# EAGLE design lcd_duffle_pth_mk_7 (EAGLE 6.5.0)
LCD Dufflebag Ride-along I2C interface for a standard LCD screen, including RGB support. Uses an ATTiny84 plus WS2811 (for backlight control). This is the PTH version
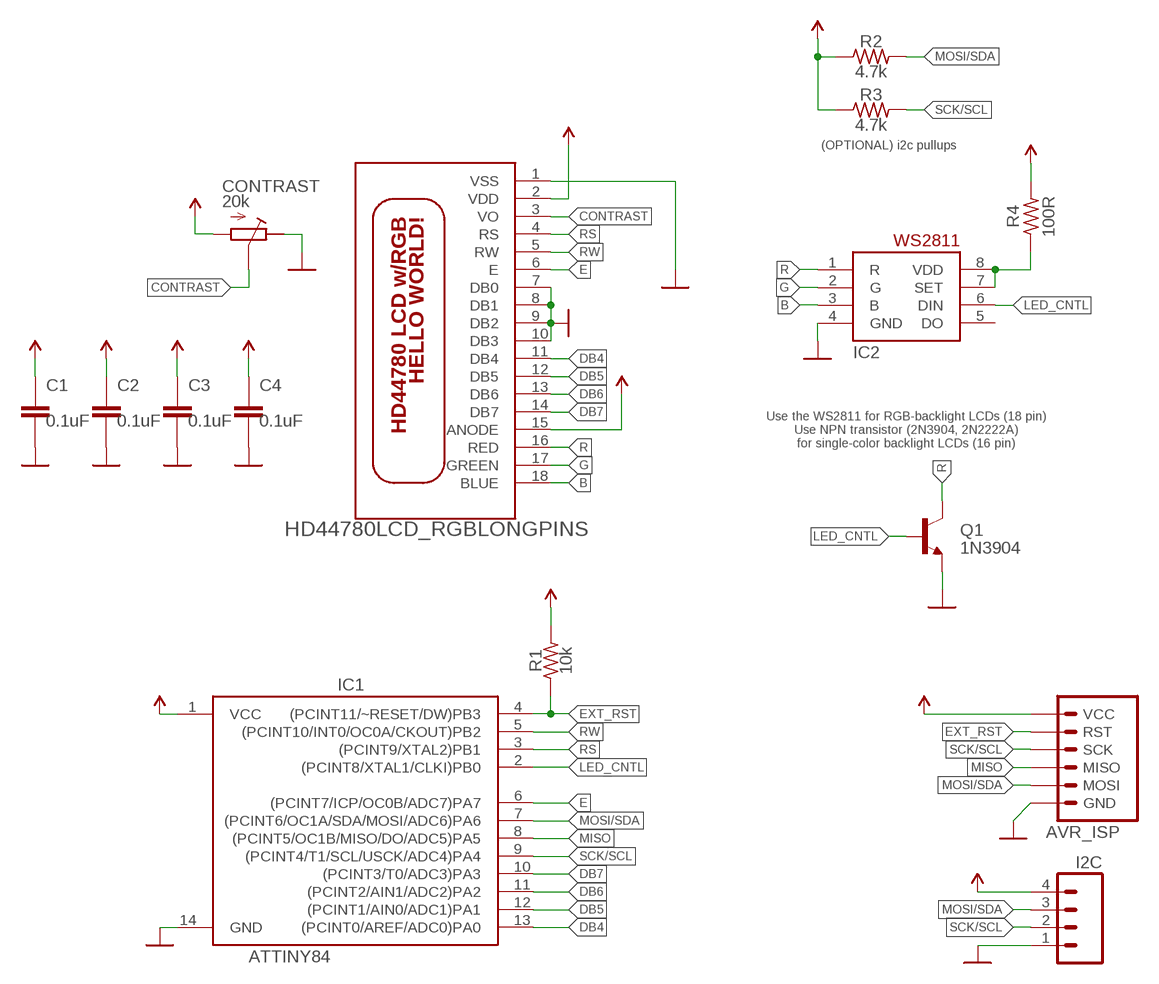
[diagram p0: schematic, sheet 1]

## Parts
AVR_ISP  AVR_MINI_PROGJST-XH-RA-PTH  [AVR_MINI_PROG_JST_XH_RA]
C1  0.1uF  CAPACITOR-CERAMIC025-024X044  [C025-024X044]
C2  0.1uF  CAPACITOR-CERAMIC025-024X044  [C025-024X044]
C3  0.1uF  CAPACITOR-CERAMIC025-024X044  [C025-024X044]
C4  0.1uF  CAPACITOR-CERAMIC025-024X044  [C025-024X044]
CONTRAST  20k  POTENTIOMETERTHUMBWHEEL-16MM  [POT-THUMBWHEEL]
I2C  M04JST_XH_RA  [JST-4-XH-RA-PTH]
IC1  ATTINY84  ATTINY84ATTINY84-20PU  [DIL14]
IC2  WS2811  WS2811-SOP8  [SO08-SKINNYPADS]
Q1  1N3904  TRANSISTOR_NPNTO-92-AMMO  [TO-92-AMMO]
R1  10k  RESISTORPTH-AXIAL-5.08MM  [RESISTOR-AXIAL-PTH-5.08MM]
R2  4.7k  RESISTORPTH-AXIAL-5.08MM  [RESISTOR-AXIAL-PTH-5.08MM]
R3  4.7k  RESISTORPTH-AXIAL-5.08MM  [RESISTOR-AXIAL-PTH-5.08MM]
R4  100R  RESISTORPTH-AXIAL-5.08MM  [RESISTOR-AXIAL-PTH-5.08MM]
U$1  HD44780LCD_RGBLONGPINS  [LCD1602-RGB-CENTERED]

## Nets
5V: AVR_ISP.2(VCC) C1.2 C2.2 C3.2 C4.2 CONTRAST.1(A) I2C.4 IC1.1(VCC) R1.P$2 R2.P$1 R3.P$1 R4.P$2 U$1.2(VDD) U$1.15(ANODE)
B: IC2.3(B) U$1.18(BLUE)
CONTRAST: CONTRAST.2(S) CONTRAST.2@1(S) U$1.3(VO)
DB4: IC1.13((PCINT0/AREF/ADC0)PA0) U$1.11(DB4)
DB5: IC1.12((PCINT1/AIN0/ADC1)PA1) U$1.12(DB5)
DB6: IC1.11((PCINT2/AIN1/ADC2)PA2) U$1.13(DB6)
DB7: IC1.10((PCINT3/T0/ADC3)PA3) U$1.14(DB7)
E: IC1.6((PCINT7/ICP/OC0B/ADC7)PA7) U$1.6(E)
EXT_RST: AVR_ISP.5(RST) IC1.4((PCINT11/~RESET/DW)PB3) R1.P$1
G: IC2.2(G) U$1.17(GREEN)
GND: AVR_ISP.6(GND) C1.1 C2.1 C3.1 C4.1 CONTRAST.3(E) I2C.1 IC1.14(GND) IC2.4(GND) Q1.1(E) U$1.1(VSS) U$1.7(DB0) U$1.8(DB1) U$1.9(DB2) U$1.10(DB3)
LED_CNTL: IC1.2((PCINT8/XTAL1/CLKI)PB0) IC2.6(DIN) Q1.2(B)
MISO: AVR_ISP.1(MISO) IC1.8((PCINT5/OC1B/MISO/DO/ADC5)PA5)
MOSI/SDA: AVR_ISP.4(MOSI) I2C.3 IC1.7((PCINT6/OC1A/SDA/MOSI/ADC6)PA6) R2.P$2
N$2: IC2.7(SET) IC2.8(VDD) R4.P$1
R: IC2.1(R) Q1.3(C) U$1.16(RED)
RS: IC1.3((PCINT9/XTAL2)PB1) U$1.4(RS)
RW: IC1.5((PCINT10/INT0/OC0A/CKOUT)PB2) U$1.5(RW)
SCK/SCL: AVR_ISP.3(SCK) I2C.2 IC1.9((PCINT4/T1/SCL/USCK/ADC4)PA4) R3.P$2
Unconnected: IC2.5(DO)

## Notes on the sheet
- (OPTIONAL) i2c pullups
- Use the WS2811 for RGB-backlight LCDs (18 pin)
  Use NPN transistor (2N3904, 2N2222A)
  for single-color backlight LCDs (16 pin)

## Library data of the parts
AVR_ISP = A_butts:AVR_MINI_PROG: AVR ISP 6-pin inline header
C1-C4 = A_butts:CAPACITOR-CERAMIC: CAPACITOR, European symbol
CONTRAST = A_butts:POTENTIOMETER: Trimm resistor
I2C = A_butts:M04: Header 4 Standard 4-pin 0.1" header. Use with straight break away headers (SKU : PRT-00116), right angle break away headers (PRT-00553), swiss pins (PRT-00743), machine pins (PRT-00117), and female headers (PRT-00115). Molex polarized connector foot print use with SKU : PRT-08231 with associated crimp pins and housings. 1MM SMD Version SKU: PRT-10208
IC1 = A_butts:ATTINY84: Atmel 14-pin 2/4/8kB flash uC
IC2 = A_butts:WS2811
Q1 = SparkFun-DiscreteSemi:TRANSISTOR_NPN: Generic NPN BJT MMBT2222A - TRANS-08049 (SOT-23, 1A 40V) MPSA42 - TRANS-09116 (SOT-23, 500mA 300V) MMBT5088LT1G - TRANS-11160 (SOT-23, 50 mA 30V) BC547 - COM-08928 <http://www.sparkfun.com/products/8928> (TO-92 45V 100mA) (1.Collector 2.Base 3.Emitter) 2N3904 - COM-00521 <http://www.sparkfun.com/products/521> (TO-92 40V 200mA) (1.Emitter 2.Base 3.Collector) P2N2222A - COM-12852 <http://www.sparkfun.com/products/12852> (TO-92 40V 600mA) (1.Collector 2.Base 3.Emitter)
R1-R4 = A_butts:RESISTOR: RESISTOR, American symbol
U$1 = A_butts:HD44780LCD_RGB

## Board
LCD Dufflebag Ride-along I2C interface for a standard LCD screen, including RGB support. Uses an ATTiny84 plus WS2811 (for backlight control). This is the PTH version
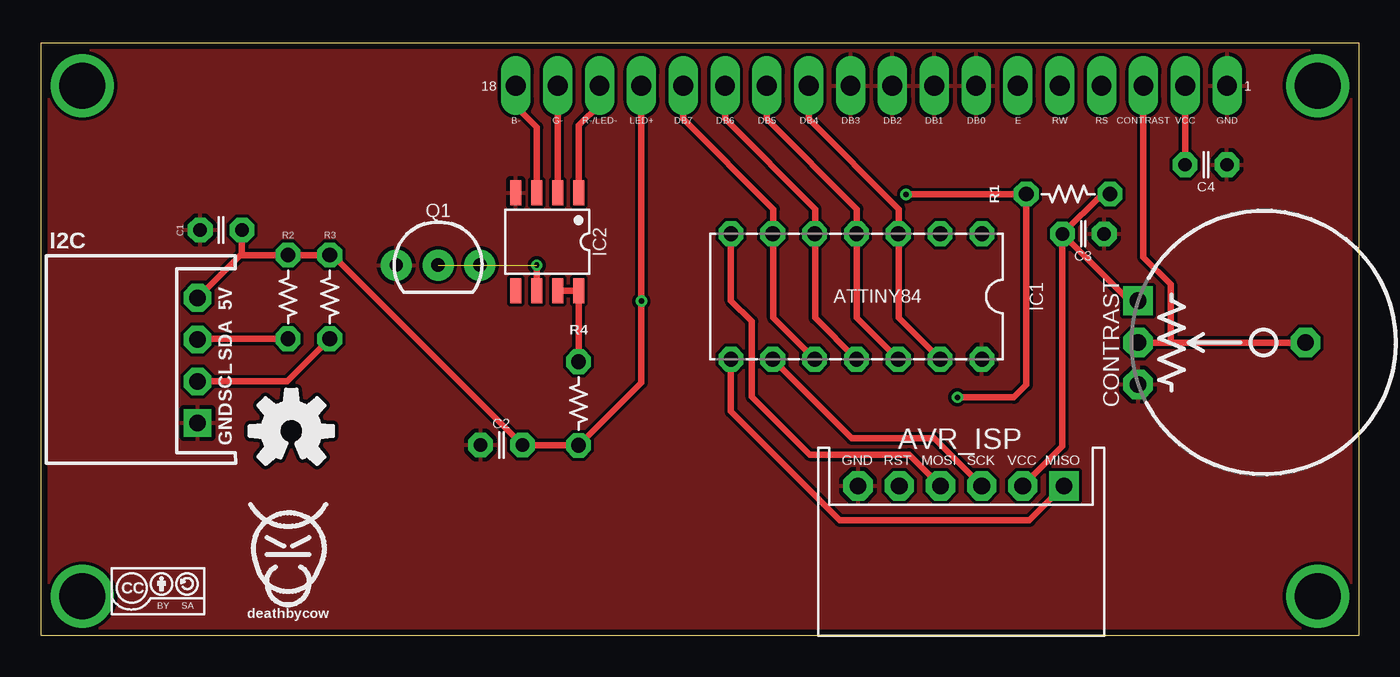
[diagram p1: board, top side]
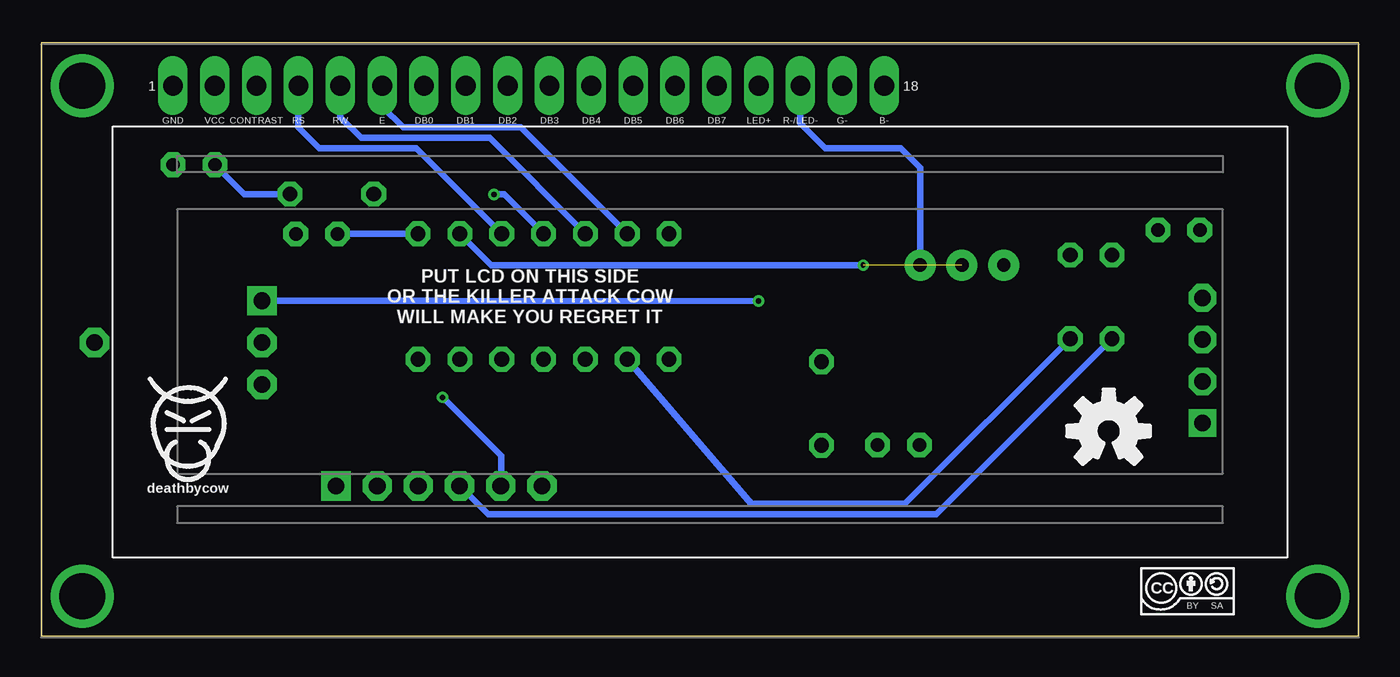
[diagram p2: board, bottom side, seen from below]

Size 80 x 36 mm. Coordinates in mm from the lower left corner, seen from the top.
Outline: 80,0 0,0 0,36 80,36 80,0
Copper layers (1*16): Top 0.0356mm / dielectric 1.5011mm / Bottom 0.0356mm
Design rules "LaenPCBOrder_2": minimum track width 6mil, minimum drill 13mil, track to track 6mil, track to pad 6mil, pad to pad 6mil, via to via 6mil, smd to smd 6mil, copper to edge 15mil, drill to drill 6mil, minimum pad ring 7mil, minimum via ring 7mil, stop-mask expansion 3mil, vias tented up to drill 20mil, thermal gap 10mil

### Footprints (pad centres in the part's own frame; a part is rotated, then mirrored left to right if it is on the bottom)
AVR_MINI_PROG_JST_XH_RA = drill 1.016 pad 1.778 square: 1 -6.25,0 | drill 1.016 pad 1.778 octagon: 2 -3.75,0; 3 -1.25,0; 4 1.25,0; 5 3.75,0; 6 6.25,0
C025-024X044 = drill 0.813 pad 1.5 octagon: 1 -1.27,0; 2 1.27,0
POT-THUMBWHEEL = drill 1.016 pad 1.778 square: 1 -2.54,0 | drill 1.016 pad 1.778 octagon: 2 0,0; 2@1 0,10.16; 3 2.54,0
JST-4-XH-RA-PTH = drill 1 pad 1.676 square: 1 0.02,0 | drill 1 pad 1.676 octagon: 2 2.54,0; 3 5.08,0; 4 7.62,0
DIL14 = drill 0.9 pad 1.5 octagon: 1 -7.62,-3.81; 2 -5.08,-3.81; 3 -2.54,-3.81; 4 0,-3.81; 5 2.54,-3.81; 6 5.08,-3.81; 7 7.62,-3.81; 8 7.62,3.81; 9 5.08,3.81; 10 2.54,3.81; 11 0,3.81; 12 -2.54,3.81; 13 -5.08,3.81; 14 -7.62,3.81
SO08-SKINNYPADS = smd 0.66 x 1.524: 1 -1.905,-2.973; 2 -0.635,-2.973; 3 0.635,-2.973; 4 1.905,-2.973; 5 1.905,2.973; 6 0.635,2.973; 7 -0.635,2.973; 8 -1.905,2.973
TO-92-AMMO = drill 0.813 pad 1.88: 1 -2.54,0; 2 0,0; 3 2.54,0
RESISTOR-AXIAL-PTH-5.08MM = drill 0.9 pad 1.5 octagon: P$1 -2.54,0; P$2 2.54,0
LCD1602-RGB-CENTERED = drill 1.2 pad 1.778 long: 1 -32,15.5; 2 -29.46,15.5; 3 -26.92,15.5; 4 -24.38,15.5; 5 -21.84,15.5; 6 -19.3,15.5; 7 -16.76,15.5; 8 -14.22,15.5; 9 -11.68,15.5; 10 -9.14,15.5; 11 -6.6,15.5; 12 -4.06,15.5; 13 -1.52,15.5; 14 1.02,15.5; 15 3.56,15.5; 16 6.1,15.5; 17 8.64,15.5; 18 11.18,15.5 | drill 2.8 pad 3.81: HOLE1 -37.5,15.5; HOLE2 37.5,15.5; HOLE3 -37.5,-15.5; HOLE4 37.5,-15.5

### Placement (x,y rotation side)
AVR_ISP  55.85,9.1 180 top
C1  10.92,24.64 0 top
C2  27.95,11.58 0 top
C3  63.27,24.4 180 top
C4  70.72,28.6 180 top
CONTRAST  66.6,17.8 270 top
I2C  9.5,12.9 90 top
IC1  49.5,20.6 180 top
IC2  30.72,23.92 180 top
Q1  24.1,22.5 0 top
R1  62.35,26.82 0 top
R2  14.99,20.57 270 top
R3  17.53,20.57 270 top
R4  32.62,14.1 270 top
U$1  40,17.9 0 bottom
U$2  [COW_SMALL]  71.09,13.04 0 bottom
U$3  [COW_SMALL]  14.99,5.44 0 top
U$4  [CC-BY-SA-4.0-NO-URL]  7.1,2.7 0 top
U$5  [OSHWLOGO_TOP_0.2_A]  15.19,12.43 0 bottom
U$6  [CC-BY-SA-4.0-NO-URL]  10.4,2.7 0 bottom
U$7  [OSHWLOGO_BOT_0.2_A]  15.19,12.43 0 bottom

### Tracks (layer width: path | path; a pad name or v marks a point on that pad's centre or on a via)
5V  (via drill 0.33)
  Top 0.4: C4.2 U$1.2 | C3.2 66.06,20.34 CONTRAST.1 | AVR_ISP.2 62,11.5 C3.2 | 12.19,23.11 R2.P$1 R3.P$1 17.69,23.11 C2.2 29.24,11.56 R4.P$2 36.44,15.38 v36.44,20.32 U$1.15 | 12.19,23.11 12.09,23.11 I2C.4 | C1.2 12.19,23.11 | C3.2 64.42,26.82 R1.P$2
  Bottom 0.4: R1.P$2 67.67,26.82 C4.2 | CONTRAST.1 55.55,20.34 v36.44,20.32 | C3.2 IC1.1
B
  Top 0.4: IC2.3 30.09,30.85 30.1,30.86 28.82,32.14 U$1.18
CONTRAST
  Top 0.4: CONTRAST.2@1 68.58,17.8 | 68.58,17.8 CONTRAST.2 | U$1.3 66.92,23 68.58,21.34 68.58,17.8
DB4
  Top 0.4: IC1.13 52.07,19.3 52.07,25.91 46.6,31.38 U$1.11
DB5
  Top 0.4: IC1.12 49.53,19.3 49.53,25.91 44.06,31.38 U$1.12
DB6
  Top 0.4: IC1.11 46.99,19.3 46.99,25.91 41.52,31.38 U$1.13
DB7
  Top 0.4: IC1.10 44.45,19.3 44.45,25.91 38.98,31.38 U$1.14
E
  Bottom 0.4: IC1.6 50.87,30.86 58.03,30.86 59.3,32.13 U$1.6
EXT_RST  (via drill 0.33)
  Top 0.4: v52.51,26.8 59.79,26.8 R1.P$1 59.81,15.24 59.05,14.48 v55.63,14.48
  Bottom 0.4: IC1.4 51.89,26.8 v52.51,26.8 | v55.63,14.48 52.07,10.92 52.07,9.13 AVR_ISP.5
G
  Top 0.4: IC2.2 U$1.17
GND
  pour Top (isolate 0.2): 80.2,0 80,35.9 0,35.9 0.06,0
LED_CNTL  (via drill 0.33)  (1 unrouted)
  Top 0.4: v30.09,22.5 IC2.6
  Bottom 0.4: IC1.2 52.67,22.5 v30.09,22.5
MISO
  Top 0.4: IC1.8 41.88,13.62 48.5,7 60,7 AVR_ISP.1
MOSI/SDA
  Top 0.4: I2C.3 9.55,18.03 R2.P$2 | IC1.7 41.88,20.35 43.15,19.08 43.15,14.5 46.65,11 52.7,11 AVR_ISP.4
  Bottom 0.4: R2.P$2 25.65,7.37 | 52.87,7.37 AVR_ISP.4
  Bottom 0.406: 25.65,7.37 52.87,7.37
N$2
  Top 0.4: IC2.7 IC2.8 R4.P$1
R
  Top 0.4: IC2.1 32.64,30.99 33.9,32.25 U$1.16
  Bottom 0.4: Q1.3 26.64,28.42 27.81,29.59 32.38,29.59 33.91,31.11 U$1.16
RS
  Bottom 0.4: U$1.4 64.38,30.86 63.11,29.59 57.22,29.59 IC1.3
RW
  Bottom 0.4: IC1.5 52.78,30.23 60.57,30.23 61.84,31.5 U$1.5
SCK/SCL
  Top 0.4: I2C.2 14.93,15.44 R3.P$2 | AVR_ISP.3 54.22,11.98 49.23,11.98 IC1.9
  Bottom 0.4: R3.P$2 27.56,8 | 36.9,8 IC1.9
  Bottom 0.406: 27.56,8 36.9,8

### Text on the board
tPlace: 5V | SDA | SCL | GND
bPlace: PUT LCD ON THIS SIDE / OR THE KILLER ATTACK COW / WILL MAKE YOU REGRET IT